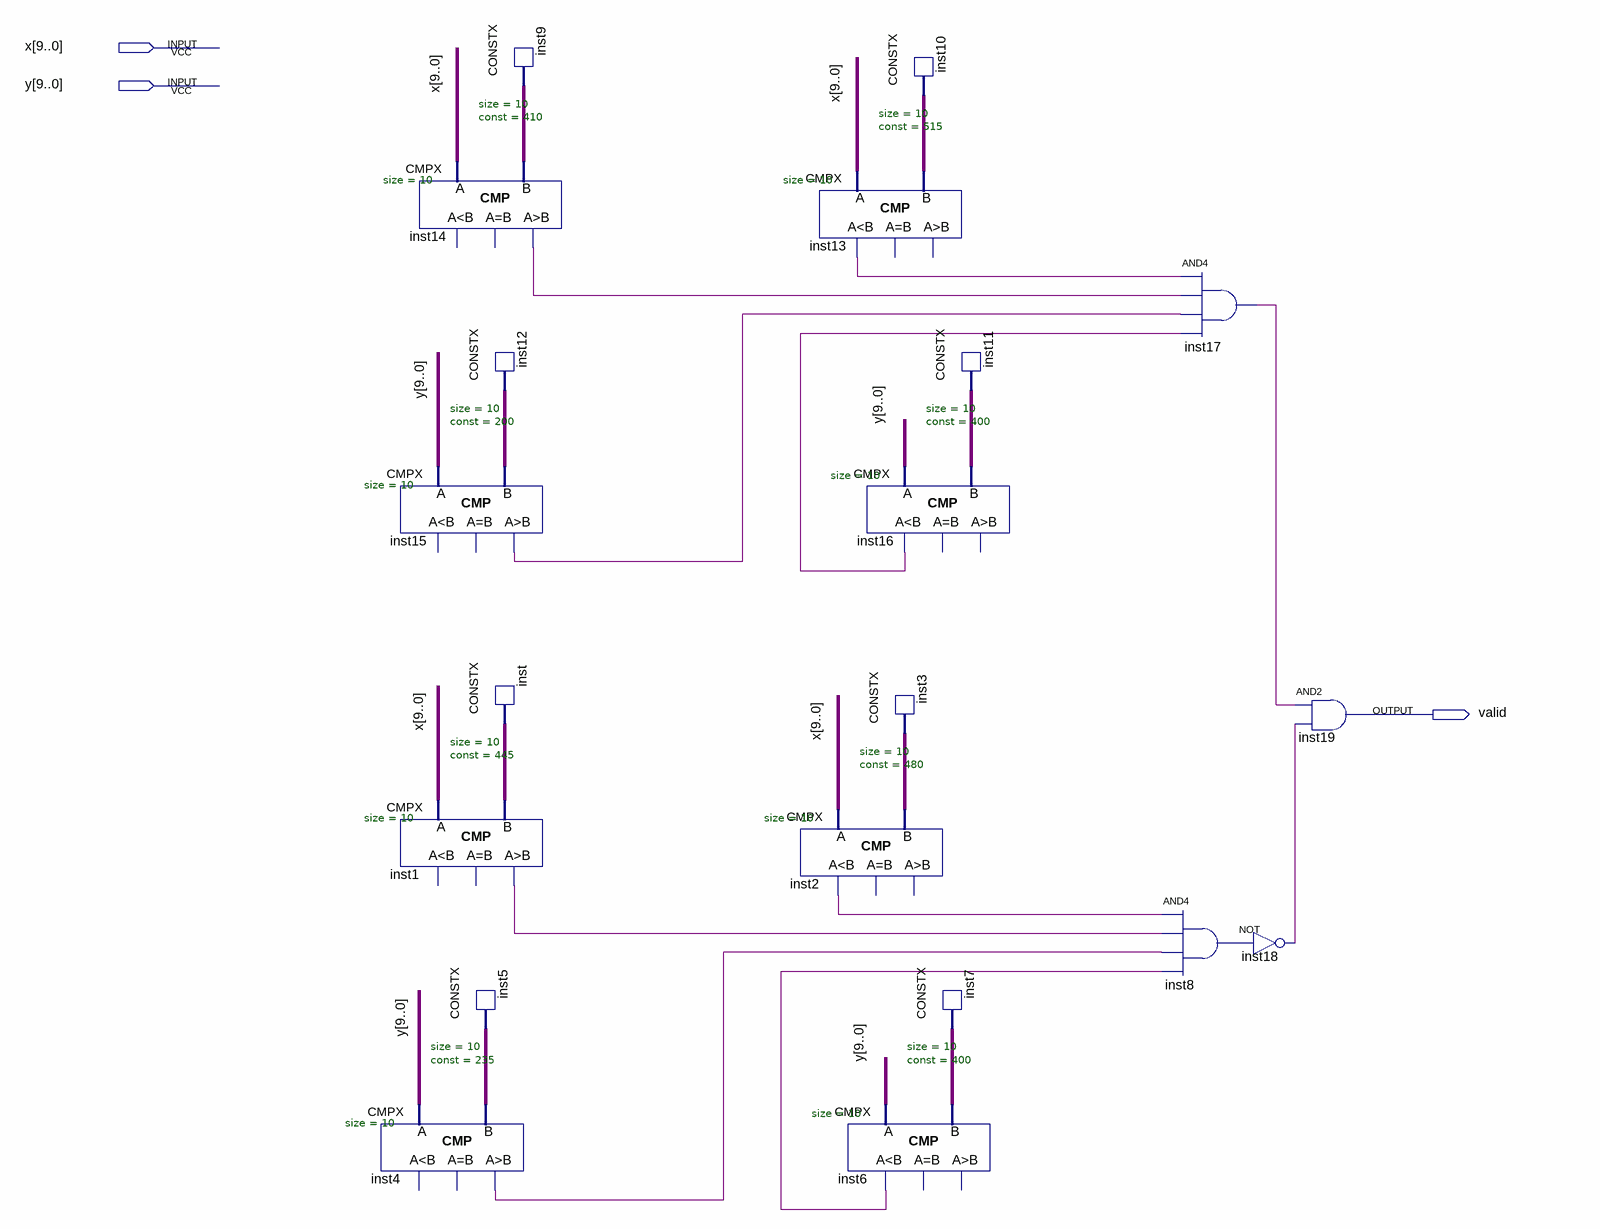
[diagram p0: schematic sheet]
// Quartus schematic Slovo_P.bdf as structural Verilog: 20 symbols, 3 pins
module Slovo_P (
  input  [9:0] x,
  input  [9:0] y,
  output valid
);

  wire inst1_gr, inst2_ls, inst4_gr, inst6_ls, inst8_out, inst13_ls, inst14_gr, inst15_gr, inst16_ls,
       inst17_out, inst18_out;
  wire [9:0] inst3_data, inst5_data, inst7_data, inst9_data, inst10_data, inst11_data, inst12_data, inst_data;

  CMPX #(.size(10)) inst4 (.A(y), .B(inst5_data), .gr(inst4_gr));  // open: ls, eq
  CMPX #(.size(10)) inst14 (.A(x), .B(inst9_data), .gr(inst14_gr));  // open: ls, eq
  CMPX #(.size(10)) inst15 (.A(y), .B(inst12_data), .gr(inst15_gr));  // open: ls, eq
  CMPX #(.size(10)) inst1 (.A(x), .B(inst_data), .gr(inst1_gr));  // open: ls, eq
  CONSTX #(.size(10), .\const (235)) inst5 (.data(inst5_data));
  CONSTX #(.size(10), .\const (410)) inst9 (.data(inst9_data));
  CONSTX #(.size(10), .\const (200)) inst12 (.data(inst12_data));
  CONSTX #(.size(10), .\const (445)) inst (.data(inst_data));
  CMPX #(.size(10)) inst13 (.A(x), .B(inst10_data), .ls(inst13_ls));  // open: eq, gr
  CMPX #(.size(10)) inst2 (.A(x), .B(inst3_data), .ls(inst2_ls));  // open: eq, gr
  CMPX #(.size(10)) inst6 (.A(y), .B(inst7_data), .ls(inst6_ls));  // open: eq, gr
  CONSTX #(.size(10), .\const (515)) inst10 (.data(inst10_data));
  CMPX #(.size(10)) inst16 (.A(y), .B(inst11_data), .ls(inst16_ls));  // open: eq, gr
  CONSTX #(.size(10), .\const (480)) inst3 (.data(inst3_data));
  CONSTX #(.size(10), .\const (400)) inst11 (.data(inst11_data));
  CONSTX #(.size(10), .\const (400)) inst7 (.data(inst7_data));
  and inst17 (inst17_out, inst13_ls, inst14_gr, inst15_gr, inst16_ls);
  and inst8 (inst8_out, inst2_ls, inst1_gr, inst4_gr, inst6_ls);
  not inst18 (inst18_out, inst8_out);
  and inst19 (valid, inst17_out, inst18_out);
endmodule
